# Altium project 28Pins_Project_V1I1.PrjPcb
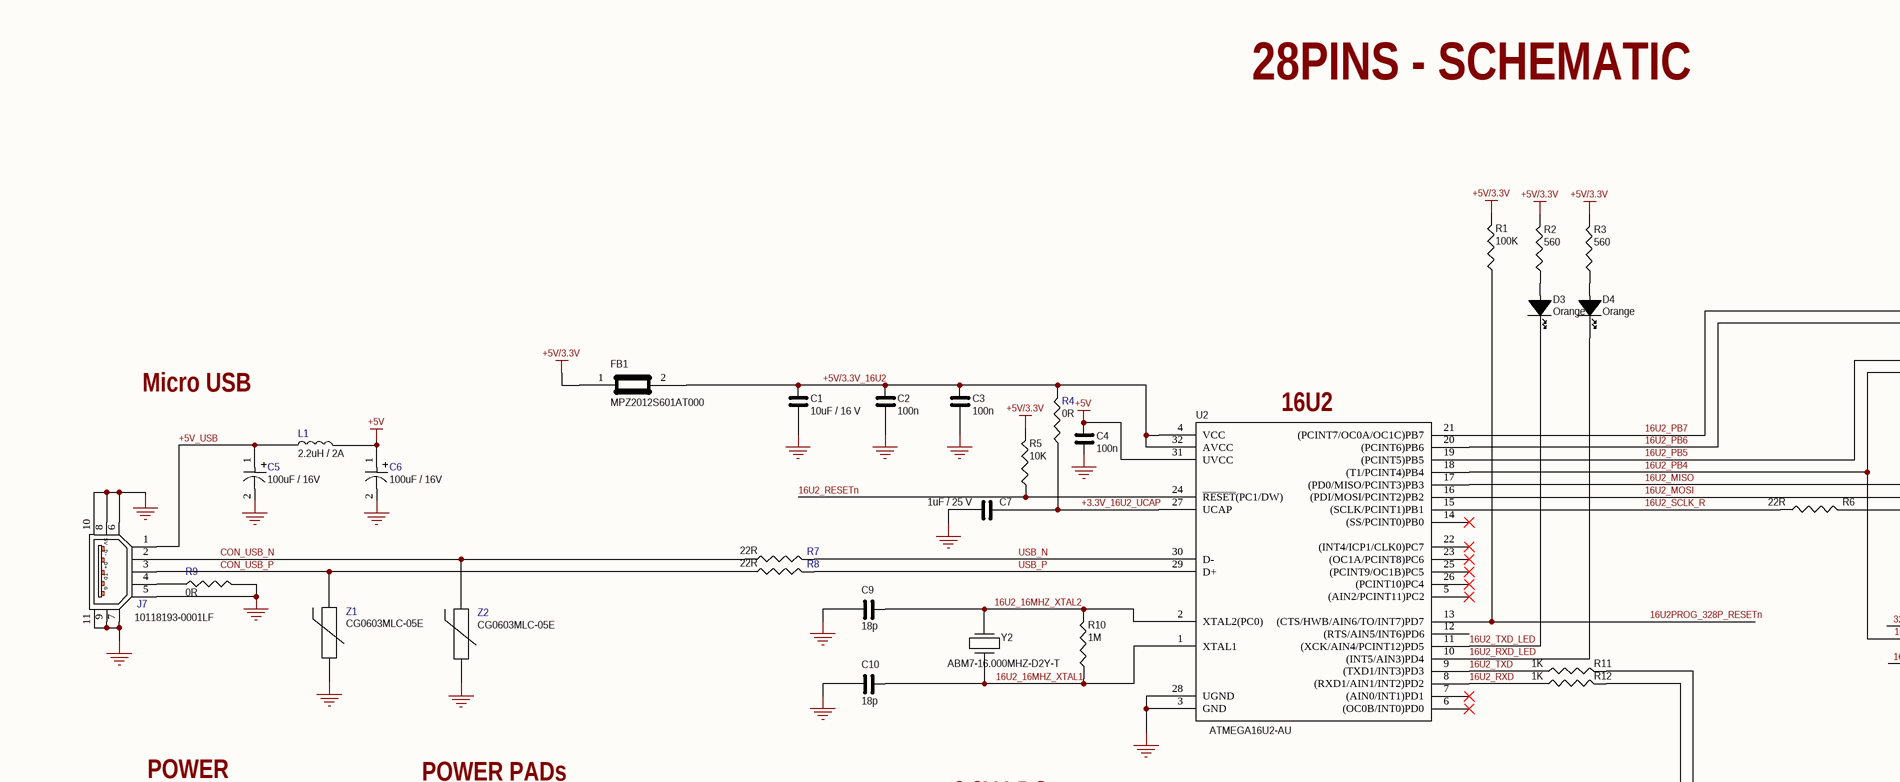
[diagram p0: 28Pins_Schematic_V1I1.SchDoc, top left]
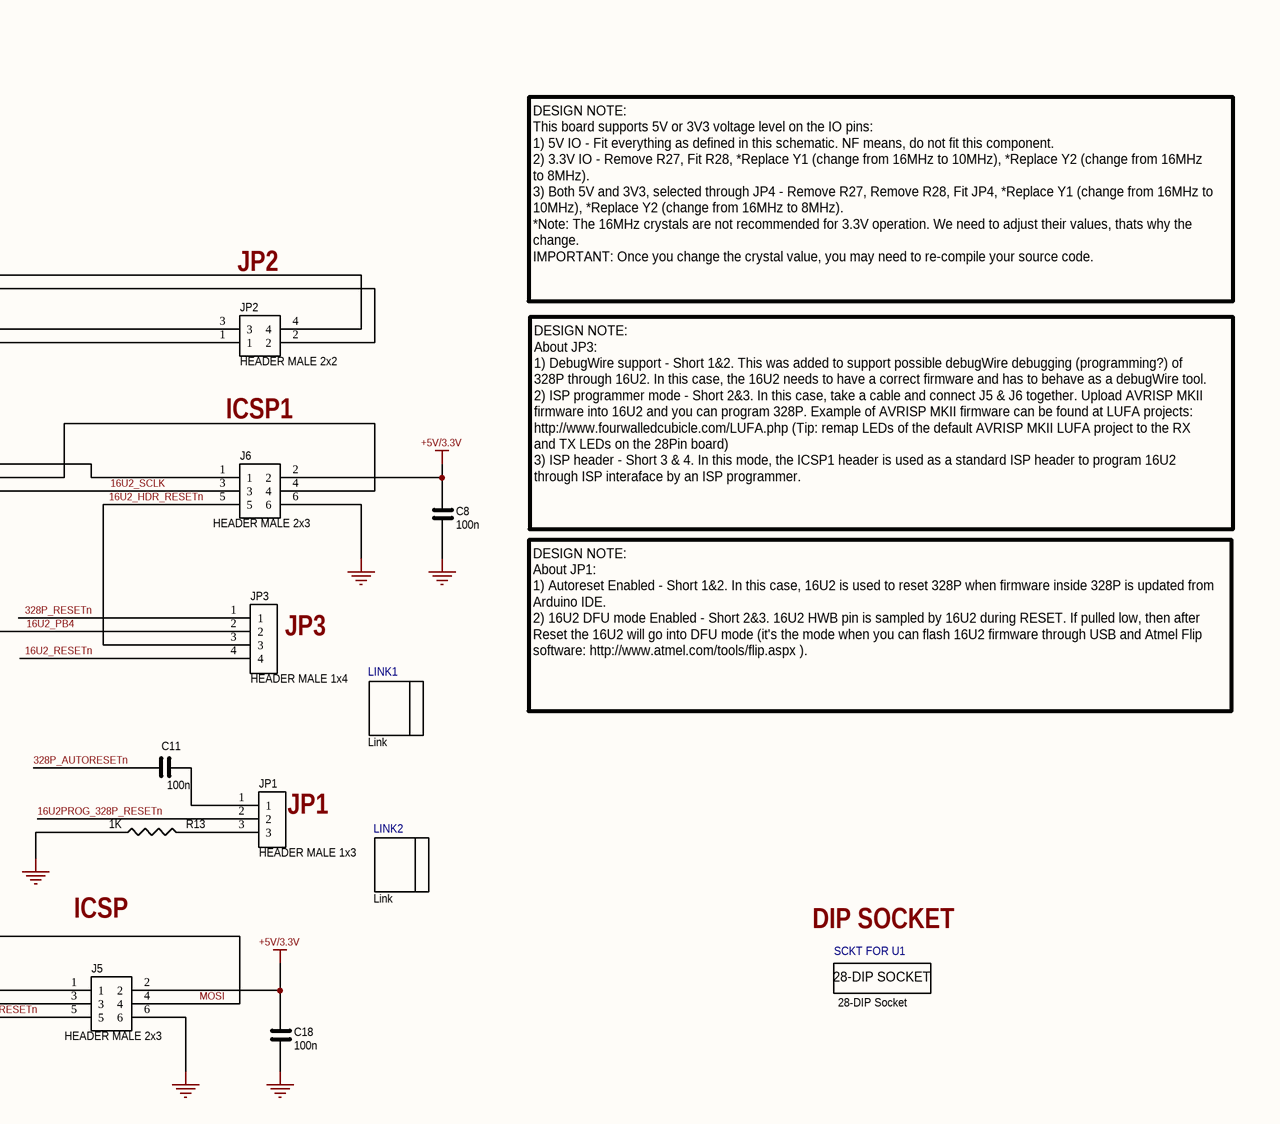
[diagram p1: 28Pins_Schematic_V1I1.SchDoc, top right]
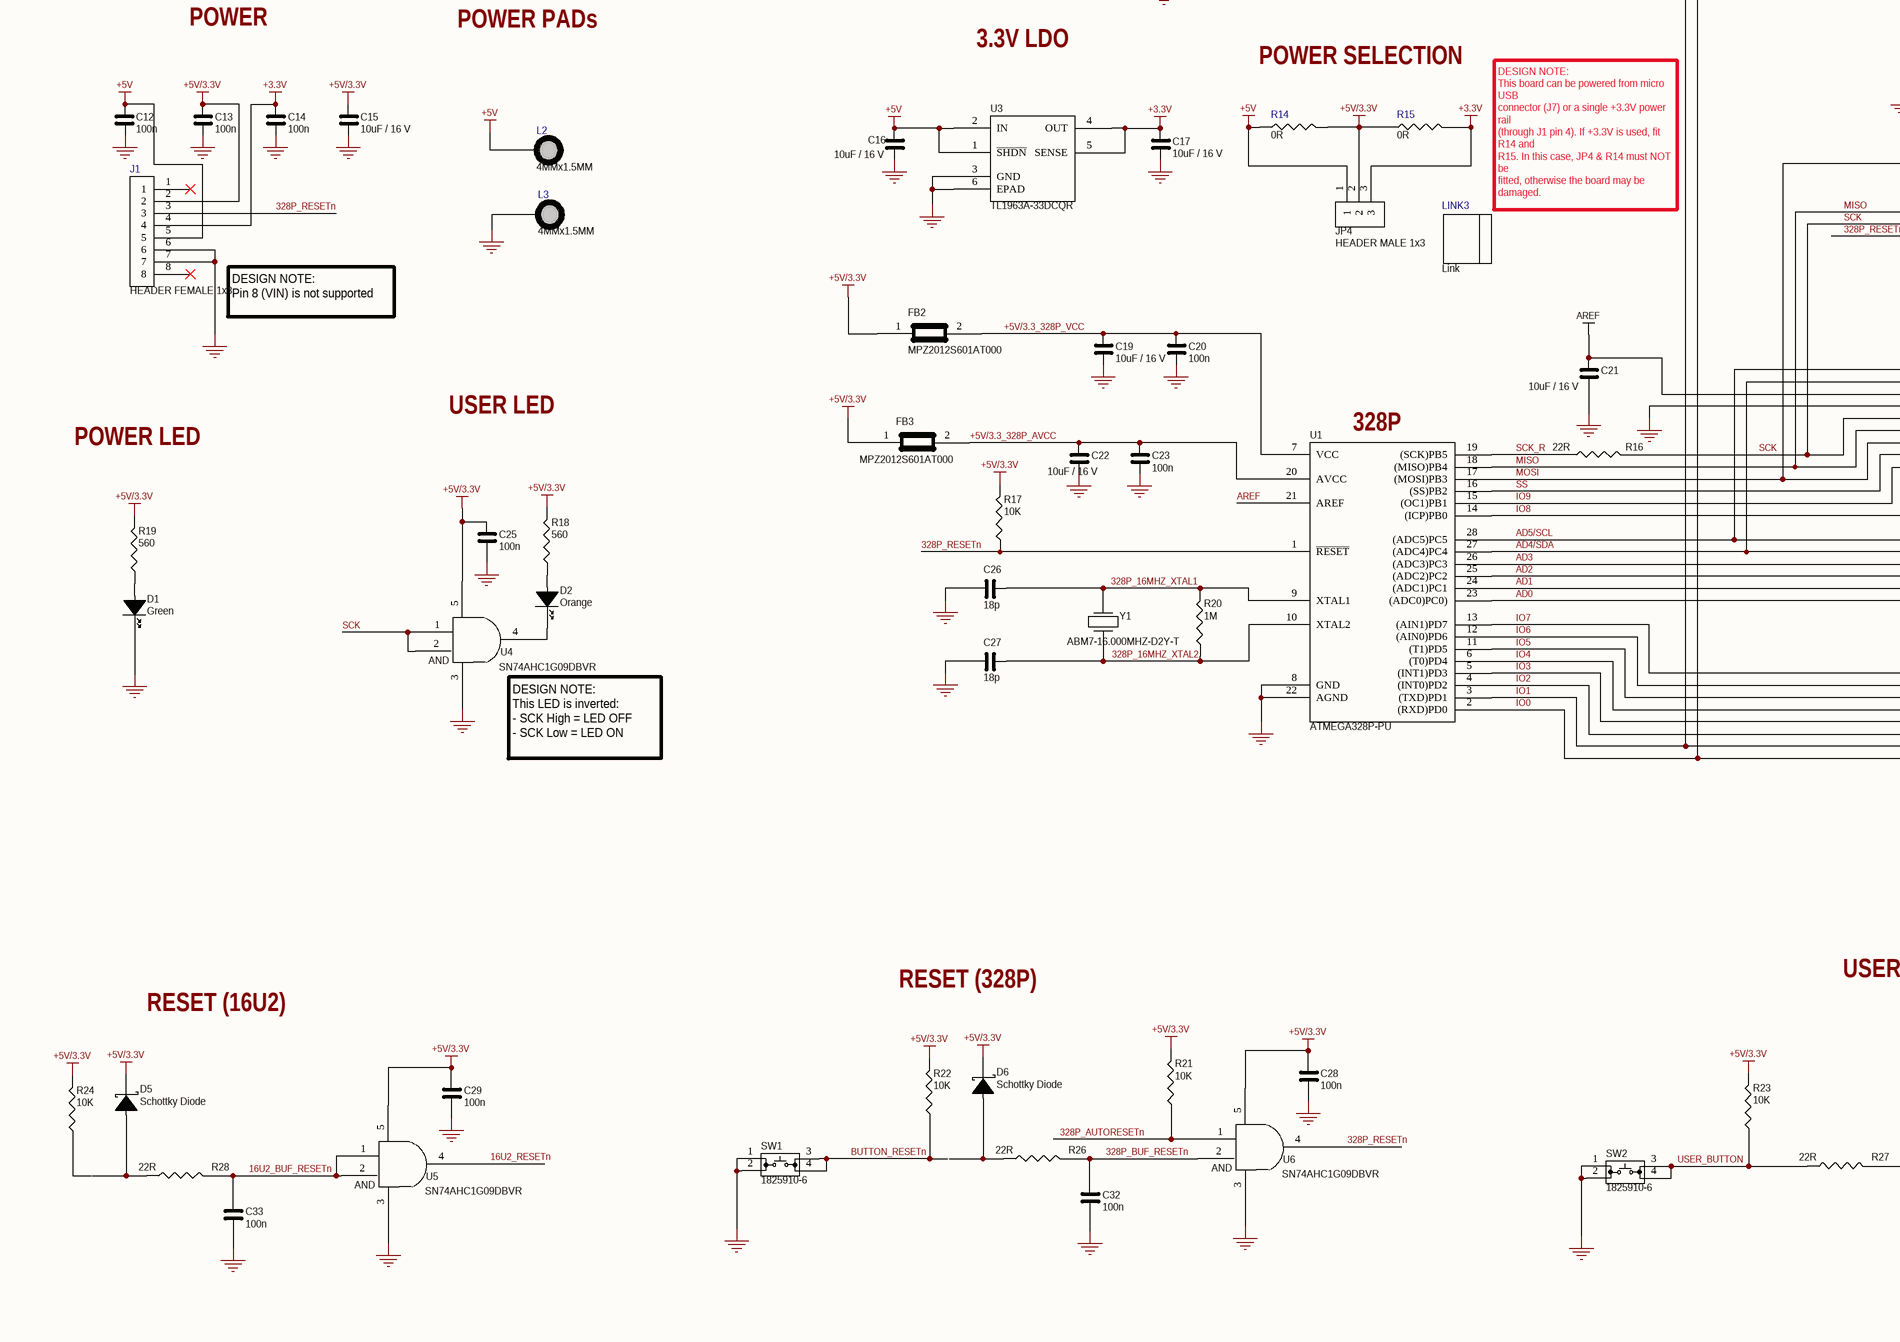
[diagram p2: 28Pins_Schematic_V1I1.SchDoc, bottom left]
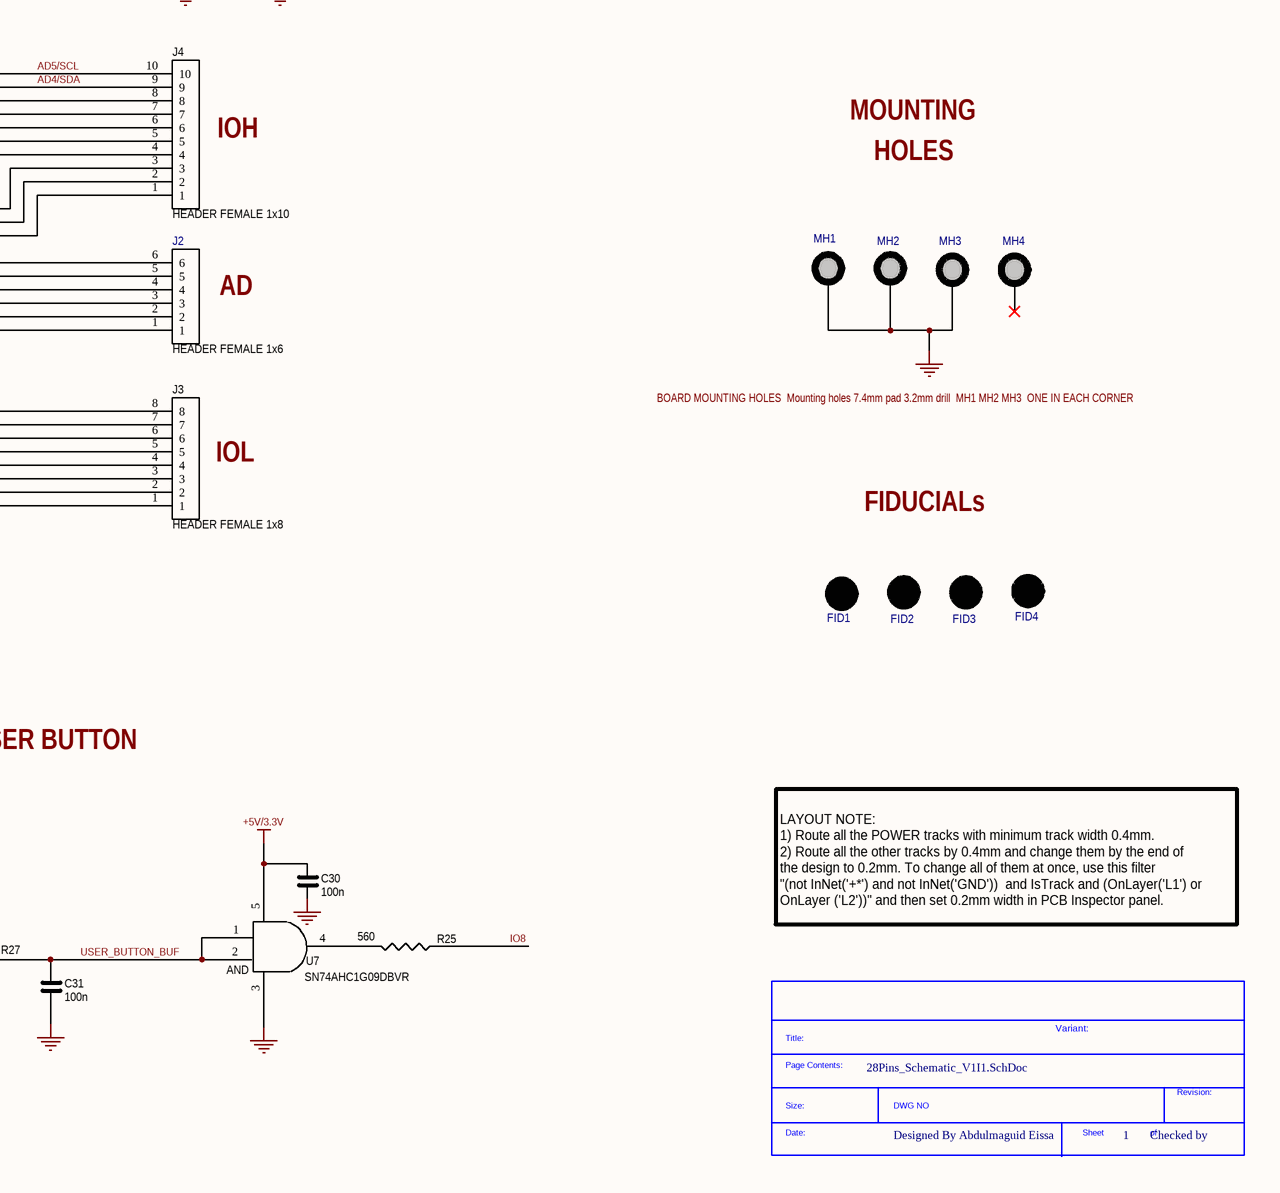
[diagram p3: 28Pins_Schematic_V1I1.SchDoc, bottom right]
VersionRevision: V1I1; Project: 28Pins; Designed By: Abdulmaguid Eissa; Company: None
1 sheet, 109 parts. Net scope: global (net labels, ports and power ports of the same name join across sheets).
Board file: 28Pins_PCB_V1I1.PcbDoc

## Sheet 28Pins_Schematic_V1I1.SchDoc
size 635 x 457 mm; DocumentNumber: 3; SheetNumber: 3; SheetTotal: 4

### Parts
*  SDTitleBlock  (value not drawn)  (graphical)
C1  10uF / 16 V  [C0805]
C2  100n  [C0805]
C3  100n  [C0805]
C4  100n  [C0805]
C5  100uF / 16V  [C_ALU_C_SIZE]
C6  100uF / 16V  [C_ALU_C_SIZE]
C7  1uF / 25 V  [C0805]
C8  100n  [C0805]
C9  18p  [C0805]
C10  18p  [C0805]
C11  100n  [C0805]
C12  100n  [C0805]
C13  100n  [C0805]
C14  100n  [C0805]
C15  10uF / 16 V  [C0805]
C16  10uF / 16 V  [C0805]
C17  10uF / 16 V  [C0805]
C18  100n  [C0805]
C19  10uF / 16 V  [C0805]
C20  100n  [C0805]
C21  10uF / 16 V  [C0805]
C22  10uF / 16 V  [C0805]
C23  100n  [C0805]
C25  100n  [C0805]
C26  18p  [C0805]
C27  18p  [C0805]
C28  100n  [C0805]
C29  100n  [C0805]
C30  100n  [C0805]
C31  100n  [C0805]
C32  100n  [C0805]
C33  100n  [C0805]
D1  Green  [LED0603]
D2  Orange  [LED0603]
D3  Orange  [LED0603]
D4  Orange  [LED0603]
D5  Schottky Diode  [SOD323]
D6  Schottky Diode  [SOD323]
FB1  MPZ2012S601AT000  [C0805]
FB2  MPZ2012S601AT000  [C0805]
FB3  MPZ2012S601AT000  [C0805]
FID1  FID_1mm  [FID_40x1120]  (value not drawn)  (no BOM)
FID2  FID_1mm  [FID_40x1120]  (value not drawn)  (no BOM)
FID3  FID_1mm  [FID_40x1120]  (value not drawn)  (no BOM)
FID4  FID_1mm  [FID_40x1120]  (value not drawn)  (no BOM)
J1  HEADER FEMALE 1x8  [1x8PIN_FEMALE_HDR]
J2  HEADER FEMALE 1x6  [1x6PIN_FEMALE_HDR]
J3  HEADER FEMALE 1x8  [1x8PIN_FEMALE_HDR]
J4  HEADER FEMALE 1x10  [1x10PIN_FEMALE_HDR]
J5  HEADER MALE 2x3  [2x3PIN_MALE_HDR]
J6  HEADER MALE 2x3  [2x3PIN_MALE_HDR]
J7  10118193-0001LF  [USB_SOP]
JP1  HEADER MALE 1x3  [1x3PIN_MALE_HDR]
JP2  HEADER MALE 2x2  [2x2PIN_MALE_HDR]
JP3  HEADER MALE 1x4  [1x4PIN_MALE_HDR]
JP4  HEADER MALE 1x3  [1x3PIN_MALE_HDR]
L1  2.2uH / 2A  [L1210]
L2  4MMx1.5MM  [PADS_WITH_WHOLE_4mmx1.5mm]  (no BOM)
L3  4MMx1.5MM  [PADS_WITH_WHOLE_4mmx1.5mm]  (no BOM)
LINK1  Link  (mechanical)
LINK2  Link  (mechanical)
LINK3  Link  (mechanical)
MH1  Mounting Whole 3.4mmx3.2mm  [MOUNTING_WHOLE_NON_COPPER]  (value not drawn)  (no BOM)
MH2  Mounting Whole 3.4mmx3.2mm  [MOUNTING_WHOLE_NON_COPPER]  (value not drawn)  (no BOM)
MH3  Mounting Whole 3.4mmx3.2mm  [MOUNTING_WHOLE_NON_COPPER]  (value not drawn)  (no BOM)
MH4  Mounting Whole 3.4mmx3.2mm  [MOUNTING_WHOLE_NON_COPPER]  (value not drawn)  (no BOM)
R1  100K  [R0805]
R2  560  [R0805]
R3  560  [R0805]
R4  0R  [R0805]
R5  10K  [R0805]
R6  22R  [R0805]
R7  22R  [R0805]
R8  22R  [R0805]
R9  0R  [R0805]
R10  1M  [R0805]
R11  1K  [R0805]
R12  1K  [R0805]
R13  1K  [R0805]
R14  0R  [R0805]
R15  0R  [R0805]
R16  22R  [R0805]
R17  10K  [R0805]
R18  560  [R0805]
R19  560  [R0805]
R20  1M  [R0805]
R21  10K  [R0805]
R22  10K  [R0805]
R23  10K  [R0805]
R24  10K  [R0805]
R25  560  [R0805]
R26  22R  [R0805]
R27  22R  [R0805]
R28  22R  [R0805]
SCKT_FOR_U1  28-DIP Socket  [28-DIP_SCKT]
SW1  1825910-6  [4PIN_BUTTON]
SW2  1825910-6  [4PIN_BUTTON]
U1  ATMEGA328P-PU  [28_DIP_U1]
U2  ATMEGA16U2-AU  [TQFP32]
U3  TL1963A-33DCQR  [DCQR R-PDSO-G6]
U4  SN74AHC1G09DBVR  [DBV_SOP_23_5]
U5  SN74AHC1G09DBVR  [DBV_SOP_23_5]
U6  SN74AHC1G09DBVR  [DBV_SOP_23_5]
U7  SN74AHC1G09DBVR  [DBV_SOP_23_5]
Y1  ABM7-16.000MHZ-D2Y-T  [AMB7_V1]
Y2  ABM7-16.000MHZ-D2Y-T  [AMB7_V1]
Z1  CG0603MLC-05E  [R0603]
Z2  CG0603MLC-05E  [R0603]

### Nets
+3.3V: C14.2 C17.2 J1.4 JP4.3 R15.2 U3.4(OUT) U3.5(SENSE)
+5V: C4.2 C6.1 C12.1 C16.2 J1.5 JP4.1 L1.2 L2.1 R14.1 U2.31(UVCC) U3.1(~{SHDN}) U3.2(IN)
+5V/3.3V: C8.2 C13.2 C15.2 C18.2 C25.2 C28.2 C29.2 C30.2 D5.1(Cathode) D6.1(Cathode) FB1.1 FB2.1 FB3.1 J1.2 J5.2 J6.2 JP4.2 R1.2 R2.2 R3.2 R5.2 R14.2 R15.1 R17.2 R18.2 R19.2 R21.2 R22.2 R23.2 R24.2 U4.5 U5.5 U6.5 U7.5
AREF: C21.2 J4.8 U1.21(AREF)
GND: C1.1 C2.1 C3.1 C4.1 C5.2 C6.2 C7.1 C8.1 C9.1 C10.1 C12.2 C13.1 C14.1 C15.1 C16.1 C17.1 C18.1 C19.1 C20.1 C21.1 C22.1 C23.1 C25.1 C26.1 C27.1 C28.1 C29.1 C30.1 C31.1 C32.1 C33.1 D1.1(Cathode) J1.6 J1.7 J4.7 J5.6 J6.6 J7.5 J7.6 J7.7 J7.8 J7.9 J7.10 J7.11 L3.1 MH1.1 MH2.1 MH3.1 R9.2 R13.1 SW1.1 SW1.2 SW2.1 SW2.2 U1.8(GND) U1.22(AGND) U2.3(GND) U2.28(UGND) U3.3(GND) U3.6(EPAD) U4.3 U5.3 U6.3 U7.3 Z1.1 Z2.1
16U2_16MHZ_XTAL1: C10.2 R10.1 U2.1(XTAL1) Y2.1
16U2_16MHZ_XTAL2: C9.2 R10.2 U2.2(XTAL2(PC0)) Y2.2
16U2_BUF_RESETn: C33.2 R28.2 U5.1 U5.2
16U2_HDR_RESETn: J6.5 JP3.3
16U2_MISO: J6.1 U2.17((PD0/MISO/PCINT3)PB3)
16U2_MOSI: J6.4 U2.16((PDI/MOSI/PCINT2)PB2)
16U2_PB4: JP2.1 JP3.2 U2.18((T1/PCINT4)PB4)
16U2_PB5: JP2.3 U2.19((PCINT5)PB5)
16U2_PB6: JP2.2 U2.20((PCINT6)PB6)
16U2_PB7: JP2.4 U2.21((PCINT7/OC0A/OC1C)PB7)
16U2_RESETn: JP3.4 R5.1 U2.24(~{RESET}(PC1/DW)) U5.4
16U2_RXD: R12.1 U2.8((RXD1/AIN1/INT2)PD2)
16U2_RXD_LED: D4.1(Cathode) U2.10((INT5/AIN3)PD4)
16U2_SCLK: J6.3 R6.2
16U2_SCLK_R: R6.1 U2.15((SCLK/PCINT1)PB1)
16U2_TXD: R11.1 U2.9((TXD1/INT3)PD3)
16U2_TXD_LED: D3.1(Cathode) U2.11((XCK/AIN4/PCINT12)PD5)
16U2PROG_328P_RESETn: JP1.2 R1.1 U2.13((CTS/HWB/AIN6/TO/INT7)PD7)
328P_16MHZ_XTAL1: C26.2 R20.2 U1.9(XTAL1) Y1.2
328P_16MHZ_XTAL2: C27.2 R20.1 U1.10(XTAL2) Y1.1
328P_AUTORESETn: C11.2 R21.1 U6.1
328P_BUF_RESETn: C32.2 R26.2 U6.2
328P_RESETn: J1.3 J5.5 JP3.1 R17.1 U1.1(~{RESET}) U6.4
+3.3V_16U2_UCAP: C7.2 R4.1 U2.27(UCAP)
+5V/3.3_328P_AVCC: C22.2 C23.2 FB3.2 U1.20(AVCC)
+5V/3.3_328P_VCC: C19.2 C20.2 FB2.2 U1.7(VCC)
+5V/3.3V_16U2: C1.2 C2.2 C3.2 FB1.2 R4.2 U2.4(VCC) U2.32(AVCC)
+5V_USB: C5.1 J7.1 L1.1
AD0: J2.1 U1.23((ADC0)PC0))
AD1: J2.2 U1.24((ADC1)PC1)
AD2: J2.3 U1.25((ADC2)PC2)
AD3: J2.4 U1.26((ADC3)PC3)
AD4/SDA: J2.5 J4.9 U1.27((ADC4)PC4)
AD5/SCL: J2.6 J4.10 U1.28((ADC5)PC5)
BUTTON_RESETn: R22.1 SW1.3 SW1.4
CON_USB_N: J7.2 R7.1 Z2.2
CON_USB_P: J7.3 R8.1 Z1.2
IO0: J3.1 R11.2 U1.2((RXD)PD0)
IO1: J3.2 R12.2 U1.3((TXD)PD1)
IO2: J3.3 U1.4((INT0)PD2)
IO3: J3.4 U1.5((INT1)PD3)
IO4: J3.5 U1.6((T0)PD4)
IO5: J3.6 U1.11((T1)PD5)
IO6: J3.7 U1.12((AIN0)PD6)
IO7: J3.8 U1.13((AIN1)PD7)
IO8: J4.1 R25.1 U1.14((ICP)PB0)
IO9: J4.2 U1.15((OC1)PB1)
MISO: J4.5 J5.1 U1.18((MISO)PB4)
MOSI: J4.4 J5.4 U1.17((MOSI)PB3)
SCK: J4.6 J5.3 R16.2 U4.1 U4.2
SCK_R: R16.1 U1.19((SCK)PB5)
SS: J4.3 U1.16((SS)PB2)
USB_N: R7.2 U2.30(D-)
USB_P: R8.2 U2.29(D+)
USER_BUTTON: R23.1 R27.1 SW2.3 SW2.4
USER_BUTTON_BUF: C31.2 R27.2 U7.1 U7.2
NetC11_1: C11.1 JP1.1
NetD1_2: D1.2(Anode) R19.1
NetD2_1: D2.1(Cathode) U4.4
NetD2_2: D2.2(Anode) R18.1
NetD3_2: D3.2(Anode) R2.1
NetD4_2: D4.2(Anode) R3.1
NetD5_2: D5.2(Anode) R28.1
NetD6_2: D6.2(Anode) R26.1
NetJ7_4: J7.4 R9.1
NetJP1_3: JP1.3 R13.2
NetR25_2: R25.2 U7.4

Not connected (* = marked no-connect by the designer): J1 1* 8*; MH4 1*; R24 1; U2 5((AIN2/PCINT11)PC2)* 6((OC0B/INT0)PD0)* 7((AIN0/INT1)PD1)* 12((RTS/AIN5/INT6)PD6) 14((SS/PCINT0)PB0)* 22((INT4/ICP1/CLK0)PC7)* 23((OC1A/PCINT8)PC6)* 25((PCINT9/OC1B)PC5)* 26((PCINT10)PC4)*

### Notes on the sheet
- 28PINS - SCHEMATIC
- (near JP2) JP2
- DESIGN NOTE:
  This board supports 5V or 3V3 voltage level on the IO pins:
  1) 5V IO - Fit everything as defined in this schematic. NF means, do not fit this component.
  2) 3.3V IO - Remove R27, Fit R28, *Replace Y1 (change from 16MHz to 10MHz), *Replace Y2 (change from 16MHz
  to 8MHz).
  3) Both 5V and 3V3, selected through JP4 - Remove R27, Remove R28, Fit JP4, *Replace Y1 (change from 16MHz to
  10MHz), *Replace Y2 (change from 16MHz to 8MHz).
  *Note: The 16MHz crystals are not recommended for 3.3V operation. We need to adjust their values, thats why the
  change.
  IMPORTANT: Once you change the crystal value, you may need to re-compile your source code.
- Micro USB
- (near U2) 16U2
- ICSP1
- DESIGN NOTE:
  About JP3:
  1) DebugWire support - Short 1&2. This was added to support possible debugWire debugging (programming?) of
  328P through 16U2. In this case, the 16U2 needs to have a correct firmware and has to behave as a debugWire tool.
  2) ISP programmer mode - Short 2&3. In this case, take a cable and connect J5 & J6 together. Upload AVRISP MKII
  firmware into 16U2 and you can program 328P. Example of AVRISP MKII firmware can be found at LUFA projects:
  http://www.fourwalledcubicle.com/LUFA.php (Tip: remap LEDs of the default AVRISP MKII LUFA project to the RX
  and TX LEDs on the 28Pin board)
  3) ISP header - Short 3 & 4. In this mode, the ICSP1 header is used as a standard ISP header to program 16U2
  through ISP interaface by an ISP programmer.
- (near JP3) JP3
- DESIGN NOTE:
  About JP1:
  1) Autoreset Enabled - Short 1&2. In this case, 16U2 is used to reset 328P when firmware inside 328P is updated from
  Arduino IDE.
  2) 16U2 DFU mode Enabled - Short 2&3. 16U2 HWB pin is sampled by 16U2 during RESET. If pulled low, then after
  Reset the 16U2 will go into DFU mode (it's the mode when you can flash 16U2 firmware through USB and Atmel Flip
  software: http://www.atmel.com/tools/flip.aspx ).
- POWER
- POWER PADs
- 3.3V LDO
- POWER SELECTION
- (near JP1) JP1
- ICSP
- DESIGN NOTE:
  This board can be powered from micro USB
  connector (J7) or a single +3.3V power rail
  (through J1 pin 4). If +3.3V is used, fit R14 and
  R15. In this case, JP4 & R14 must NOT be
  fitted, otherwise the board may be damaged.
- (near SCKT_FOR_U1) DIP SOCKET
- DESIGN NOTE:
  Pin 8 (VIN) is not supported
- POWER LED
- USER LED
- (near U1) 328P
- (near J4) IOH
- MOUNTING
- HOLES
- (near J2) AD
- BOARD MOUNTING HOLES  Mounting holes 7.4mm pad 3.2mm drill  MH1 MH2 MH3  ONE IN EACH CORNER
- (near U4) DESIGN NOTE:
  This LED is inverted:
  - SCK High = LED OFF
  - SCK Low = LED ON
- (near J3) IOL
- FIDUCIALs
- RESET (328P)
- USER BUTTON
- RESET (16U2)
- LAYOUT NOTE:
  1) Route all the POWER tracks with minimum track width 0.4mm.
  2) Route all the other tracks by 0.4mm and change them by the end of
  the design to 0.2mm. To change all of them at once, use this filter
  "(not InNet('+*') and not InNet('GND'))  and IsTrack and (OnLayer('L1') or
  OnLayer ('L2'))" and then set 0.2mm width in PCB Inspector panel.
- Variant:
- 28Pins_Schematic_V1I1.SchDoc
- Designed By Abdulmaguid Eissa
- 1
- Checked by
- (in symbol 28Pin_DIP) 28-DIP SOCKET
- (in symbol 10118193-0001LF) 5V; D-; D+; ID; G
- (in symbol AND gate) AND
- (in symbol SDTitleBlock) Title:; Page Contents:; Revision:; Size:; DWG NO; Date:; Sheet; of

### Library data of the parts
C1 C15-C17 C19 C21 C22 = 10uF_CAP
C2-C4 C8 C11-C14 C18 C20 C23 C25 C28-C33 = 0.1uF_CAP
C5 C6 = 100uF_PCAP
C7 = 1uF_CAP
C9 C10 C26 C27 = 18pF_CAP
D1 = LED_Green
D2-D4 = LED_Orange
D5 D6 = Schottky Diode: Diode,Schottky Barrier,Fast,Vr 30V,If 200mA,Pkg SOD-323,Vf 0.52VDC,Trr 5ns; Manufacturer: ON Semiconductor; Manufacturer Part Number: BAT54HT1G; Supplier 1: Allied; RoHS: No; Stock 1: 4340; Pricing 1: 10=0.0946, 100=0.0936, 250=0.0927 (USD); ComponentLink1URL: https://www.alliedelec.com/m/d/32ed7fc37a0b4f97ae8b34bd526f7e4f.pdf; ComponentLink1Description: https://www.alliedelec.com/m/d/32ed7fc37a0b4f97ae8b34bd526f7e4f.pdf; ComponentLink2URL: https://www.alliedelec.com/onsemiconductor-bat54ht1g/70099482/; ComponentLink2Description: https://www.alliedelec.com/onsemiconductor-bat54ht1g/70099482/; Supplier Part Number 1: 70099482
FB1-FB3 = Ferrite_Bead
FID1-FID4 = Fiducial: Fiducial 40mil diameter
J1 J3 = 1x8Pin_Female_Hdr
J2 = 1x6Pin_Female_Hdr
J4 = 10Pin_Female_Hdr
J5 J6 = 2x3Pin_Male_Hdr
J7 = 10118193-0001LF: Right Angle Surface Mount Mount Female USB Connector 100 V ac 1.8A; Manufacturer: Amphenol ICC; Supplier 1: Allied; Manufacturer Part Number: 10118193-0001LF; RoHS: No; Stock 1: 6540; Pricing 1: 1=0.2919, 25=0.2747, 100=0.2661, 250=0.2318, 500=0.2276 (USD); ComponentLink1URL: https://www.alliedelec.com/m/d/e03afc8e486ea55a2b0205fb8203b916.pdf; ComponentLink1Description: https://www.alliedelec.com/m/d/e03afc8e486ea55a2b0205fb8203b916.pdf; ComponentLink2URL: https://www.alliedelec.com/amphenolicc-10118193-0001lf/70236827/; ComponentLink2Description: https://www.alliedelec.com/amphenolicc-10118193-0001lf/70236827/; Supplier Part Number 1: 70236827
JP1 JP4 = 1x3Pin_Male_Hdr
JP2 = 2x2Pin_Male_Hdr
JP3 = 1x4Pin_Male_Hdr
L1 = L1210R2R2MDWIT: Inductor
L2 L3 = PAD_WITH_WHOLE_4MMx1.5MM
LINK1-LINK3 = Link: CONN JUMPER
MH1-MH4 = MOUNTING_WHOLE_NON_COPPER
R1 = 100K_Resistor
R2 R3 R18 R19 R25 = 560_Resistor
R4 R9 R14 R15 = 0R_Resistor
R5 R17 R21-R24 = 10K_Resistor
R6-R8 R16 R26-R28 = 22_Resistor
R10 R20 = 1M_Resistor
R11-R13 = 1K_Resistor
SCKT_FOR_U1 = 28Pin_DIP
SW1 SW2 = 4Pin_Push_Button: Push_Button
U1 = ATMEGA328P-PU: ATMEGA328P-PU; 8 bit Microcontroller AVR 20MHz 1; 32kb Flash; 2kb RAM; I2C SPI 2; Manufacturer: Microchip Technology Inc.; Supplier 1: Allied; RoHS: No; Stock 1: 0; Pricing 1: 1=5.1200, 5=4.6100, 10=4.1800, 25=3.8300, 100=3.5500 (USD); ComponentLink1URL: https://www.alliedelec.com/m/d/768ce6a229d36838fb8bd4dcb29bd26e.pdf; ComponentLink1Description: https://www.alliedelec.com/m/d/768ce6a229d36838fb8bd4dcb29bd26e.pdf; ComponentLink2URL: https://www.alliedelec.com/microchiptechnologyinc-atmega328p-pu/70332157/; ComponentLink2Description: https://www.alliedelec.com/microchiptechnologyinc-atmega328p-pu/70332157/; Supplier Part Number 1: 70332157; Manufacturer Part Number: ATMEGA328P-PU
U3 = Regulator
U4-U7 = AND gate
Y1 Y2 = ABM7-16.000MHZ-D2Y-T: Crystal; Ceramic; 16.000MHZ; 18pf; 20ppm @ 25C; 30ppm -40+85C; 6.0 x 3.5 x 1.2mm; T/R; Manufacturer: Abracon; Supplier 1: Allied; RoHS: No; Stock 1: 0; Pricing 1: 1000=0.5800 (USD); ComponentLink1URL: https://www.alliedelec.com; ComponentLink1Description: https://www.alliedelec.com; ComponentLink2URL: https://www.alliedelec.com/abracon-abm7-16-000mhz-d2y-t/71528095/; ComponentLink2Description: https://www.alliedelec.com/abracon-abm7-16-000mhz-d2y-t/71528095/; Supplier Part Number 1: 71528095; Manufacturer Part Number: ABM7-16.000MHZ-D2Y-T
Z1 Z2 = CG0603MLC-05E: Varistor; ESD Clamp Protector; 5 VDC; 20 Vclamp; IEC 61000-4-2 Level 4; 0603 SMD; Manufacturer: Bourns; Supplier 1: Allied; Manufacturer Part Number: CG0603MLC-05E; RoHS: No; Stock 1: 7999; Pricing 1: 1=0.1100, 1250=0.1067, 2500=0.1012, 12500=0.0946, 25000=0.0869, 125000=0.0682 (USD); ComponentLink1URL: https://www.alliedelec.com/m/d/c74d21cd372fe06fa9c5b8b4ec8a7246.pdf; ComponentLink1Description: https://www.alliedelec.com/m/d/c74d21cd372fe06fa9c5b8b4ec8a7246.pdf; ComponentLink2URL: https://www.alliedelec.com/bourns-cg0603mlc-05e/70153503/; ComponentLink2Description: https://www.alliedelec.com/bourns-cg0603mlc-05e/70153503/; Supplier Part Number 1: 70153503

## Assembly variants
FIXED 5V: not fitted JP4 LINK3 R14